# Altium schematic sheet MOD-SH-RFDET-01.SchDoc
size 558 x 431 mm; Date: Not shown in title block; ApprovedBy: Not shown in title block; CheckedBy: Not shown in title block; Author: Not shown in title block; CompanyName: Not shown in title block; Engineer: Not shown in title block; Organization: Not shown in title block; Address1: Not shown in title block; Address2: Not shown in title block; Address3: Not shown in title block; Address4: Not shown in title block; DocumentNumber: 2; Revision: Use project parameter SCH_Rev; SheetNumber: 2; SheetTotal: 3; PageSetup: Record=PageOptions|CenterHorizontal=True|CenterVertical=True|PrintScale=1.00|XCorrection=1.00|YCorrection=1.00|PrintKind=0|BorderSize=5000000|LeftOffset=0|BottomOffset=0|Orientation=2|PaperLength=1000|PaperWidth=1000|Scale=100|PaperSource=15|PrintQuality=600|MediaType=1|DitherType=10|PaperKind=Letter|PrintScaleMode=1; SPICEModelCacheSBTADDDQ: <root> / <DocumentId>SBTADDDQ</DocumentId> / <CacheFrame Number="0"> / <Model Name="7332_744878101_100u" Kind="CKT"> / <Text>****** / .subckt 7332_744878101_100u  1  2  3  4  PARAMS: / +  Cww=9.41p / +  Rp1=63426.1945521 / +  Cp1=10.419700222087p / +  Lp1=87.02321671935u / +  Rp2=63426.1945521 / +  Cp2=10.419700222087p / +  Lp2=87.02321671935u / +  RDC1=1.16899999976158 / +  RDC2=1.16899999976158 / +  K=0.938248462535577 / C_C1  2  1    {Cww/2} / R_R50  2  1  5000g / C_C2  3  4    {Cww/2} / C_C5  3  2    {Cp1} / R_R1  3  N05454    {RDC1} / R_R2  3  2    {Rp1} / L_L1  N05454  2    {Lp1} / L_L2  N05750  1    {Lp2} / C_C6  4  1    {Cp2} / R_R3  4  1    {Rp2} / R_R4  4  N05750    {RDC2} / Kn_K1  L_L1  L_L2      {K} / .ends</Text> / </Model> / </CacheFrame> / </root>; CurrentTime: Not shown in title block; CurrentDate: Not shown in title block; Time: Not shown in title block; DocumentFullPathAndName: Not shown in title block; DocumentName: Not shown in title block; ModifiedDate: Not shown in title block; ImagePath: Not shown in title block
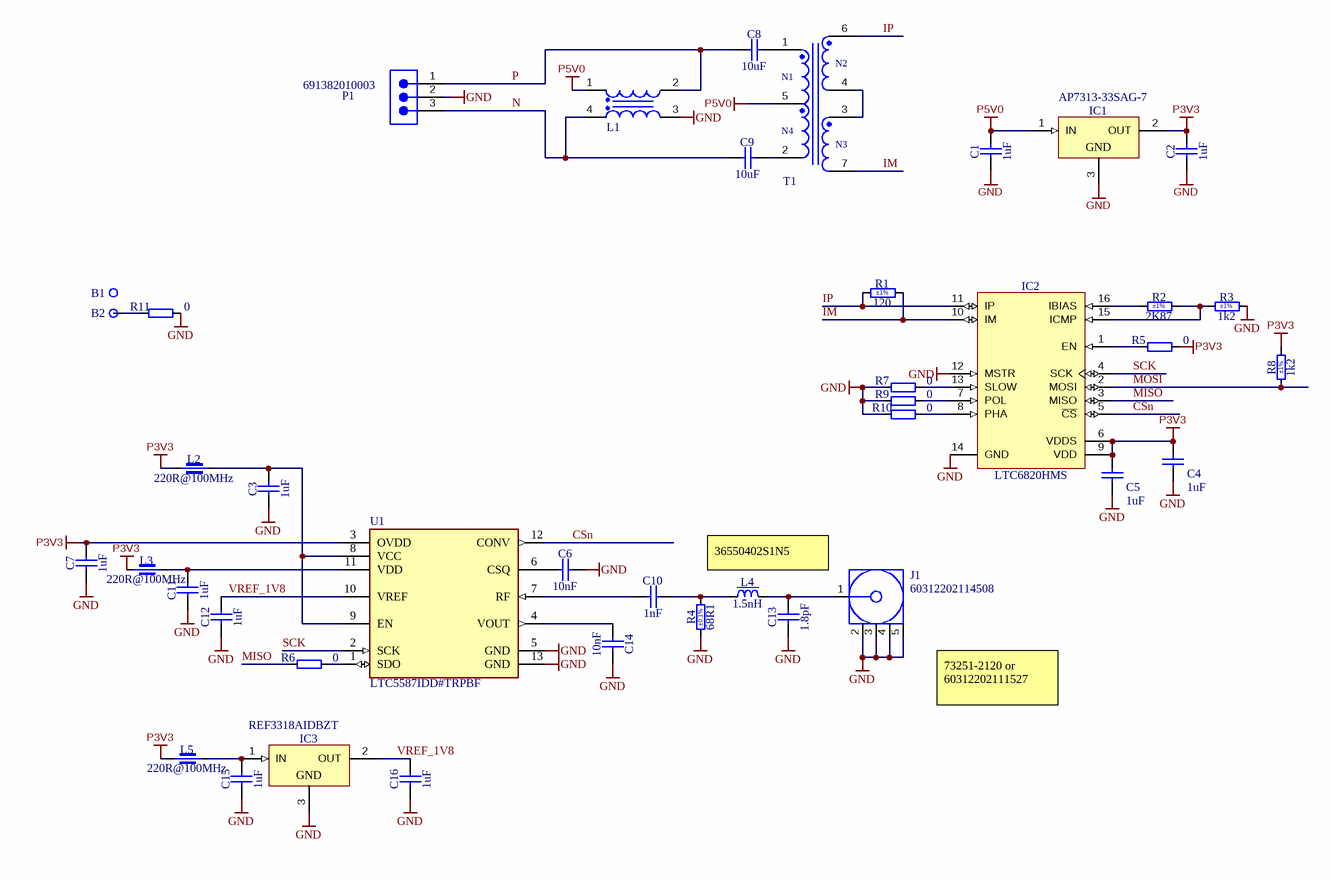
[diagram p0: MOD-SH-RFDET-01.SchDoc]

## Parts
B1  Plated Hole  [MTG320_550]  (value not drawn)  (no BOM)
B2  Plated Hole  [MTG320_550]  (value not drawn)  (no BOM)
C1  1uF  [CAPC1005X55N]
C2  1uF  [CAPC1005X55N]
C3  1uF  [CAPC1005X55N]
C4  1uF  [CAPC1005X55N]
C5  1uF  [CAPC1005X55N]
C6  10nF  [CAPC1608X87N]
C7  1uF  [CAPC1005X55N]
C8  10uF  [CAPC1608X80N]
C9  10uF  [CAPC1608X80N]
C10  1nF  [CAPC1005X55N]
C11  1uF  [CAPC1005X55N]
C12  1uF  [CAPC1005X55N]
C13  1.8pF  [CAPC1005X55N]
C14  10nF  [CAPC1608X87N]
C15  1uF  [CAPC1005X55N]
C16  1uF  [CAPC1005X55N]
IC1  AP7313-33SAG-7  [SOT95P240X130-3N]
IC2  LTC6820HMS  [SOP50P490X110-16N]
IC3  REF3318AIDBZT  [SOT95P237X112-3N]
J1  60312202114508  [60312202114508]
L1  100µH, 0.3A  [WE-DD_7332]  (value not drawn)
L2  220R@100MHz  [INDC1608X95N]
L3  220R@100MHz  [INDC1608X95N]
L4  1.5nH  [IND_MURATA_LQP15MN_02]
L5  220R@100MHz  [INDC1608X95N]
P1  691382010003  [691382010003]
R1  120  Tolerance: ±1%  [RESC1608X55N]
R2  2K87  Tolerance: ±1%  [RESC1005X40N]
R3  1k2  Tolerance: ±1%  [RESC1005X40N]
R4  68R1  Tolerance: ±0.1%  [RESC2012X60N]
R5  0  [RESC1005X40N]
R6  0  [RESC1005X40N]
R7  0  [RESC1005X40N]
R8  1k2  Tolerance: ±1%  [RESC1005X40N]
R9  0  [RESC1005X40N]
R10  0  [RESC1005X40N]
R11  0  [RESC1005X40N]
T1  74930030  [74930030]  (value not drawn)
U1  LTC5587IDD#TRPBF  [FP-DD-12-05-08-1725-IPC_A]

## Nets
GND: C1.1 C2.1 C3.1 C4.1 C5.1 C6.2 C7.1 C11.1 C12.1 C13.1 C14.2 C15.1 C16.1 IC1.3(GND) IC2.12(MSTR) IC2.14(GND) IC3.3(GND) J1.2(GND) J1.3(GND) J1.4(GND) J1.5(GND) L1.3 P1.2 R3.2 R4.1 R7.1 R9.1 R10.1 R11.2 U1.5(GND) U1.13(GND)
P3V3: C2.2 C4.2 C5.2 C7.2 IC1.2(OUT) IC2.6(VDDS) IC2.9(VDD) L2.1 L3.1 L5.1 R5.2 R8.2 U1.3(OVDD)
P5V0: C1.2 IC1.1(IN) L1.1 T1.5
CSn: IC2.5(~{CS}) U1.12(CONV)
IM: IC2.10(IM) R1.2 T1.7
IP: IC2.11(IP) R1.1 T1.6
MISO: IC2.3(MISO) R6.1
MOSI: IC2.2(MOSI) R8.1
N: C9.1 L1.4 P1.3
P: C8.1 L1.2 P1.1
SCK: IC2.4(SCK) U1.2(SCK)
VREF_1V8: C12.2 C16.2 IC3.2(OUT) U1.10(VREF)
NetB2_1: B2.1 R11.1
NetC3_2: C3.2 L2.2 U1.8(VCC) U1.9(EN)
NetC6_1: C6.1 U1.6(CSQ)
NetC8_2: C8.2 T1.1
NetC9_2: C9.2 T1.2
NetC10_1: C10.1 U1.7(RF)
NetC10_2: C10.2 L4.1 R4.2
NetC11_2: C11.2 L3.2 U1.11(VDD)
NetC13_2: C13.2 J1.1(Signal) L4.2
NetC14_1: C14.1 U1.4(VOUT)
NetC15_2: C15.2 IC3.1(IN) L5.2
NetIC2_1: IC2.1(EN) R5.1
NetIC2_7: IC2.7(POL) R9.2
NetIC2_8: IC2.8(PHA) R10.2
NetIC2_13: IC2.13(SLOW) R7.2
NetIC2_15: IC2.15(ICMP) R2.2 R3.1
NetIC2_16: IC2.16(IBIAS) R2.1
NetR6_2: R6.2 U1.1(SDO)
NetT1_3: T1.3 T1.4

Not connected (* = marked no-connect by the designer): B1 1

## Notes on the sheet
- 36550402S1N5
- (near J1) 73251-2120 or
  60312202111527
- Drawn By:
- SVN Rev:
- Number:
- TID #:
- Orderable:
- Rev:
- Sheet Title:
- File:
- Project Title:
- Designed for:
- Assembly Variant:
- Mod. Date:
- Sheet:
- Size:
- of
- C
- http://www.ti.com
- Texas Instruments and/or its licensors do not warrant the accuracy or completeness of this specification or any information contained therein. Texas Instruments and/or its licensors do not warrant that this design will meet the specifications, will be suitable for your application or fit for any particular purpose, or will operate in an implementation. Texas Instruments and/or its licensors do not warrant that the design is production worthy. You should completely validate and test your design implementation to confirm the system functionality for your application.
- Engineer:
- Contact:
- © Texas Instruments
- (in symbol 74930030) N2; N1; N4; N3

## Library data of the parts
B1 B2 = PLATED_HOLE3.2_PAD5.5: Single Terminal Socket; Part Description: Plated Through Hole: Hole Dia.=3.2mm Pad Dia.=5.5mm; Mounted: No; Part Number: PLATED_HOLE3.2_PAD5.5; Component Type: Standard (No BOM); Pin Count: 1; Family: Plated Hole; Socket: No; SMD: No; Sense: No; Status: None; ComponentHeight: 0mm; HelpURL: Undefined; Author: CERN DEM JMW; CreateDate: 01.10.2012; LatestRevisionDate: 01.10.2012; PackageDescription: Plated Through Hole: Hole Dia.=3.2mm Pad Dia.=5.5mm
C1-C5 C7 C11 C12 C15 C16 = CC0402_1UF_16V_10%_X5R: Non-polarised capacitor; Part Description: SMD Multilayer Chip Ceramic Capacitor; Manufacturer: GENERIC; Manufacturer1 Part Number: C1005X5R1C105KT; Voltage: 16V; TC: X5R; Tolerance: ±10%; Part Number: CC0402_1UF_16V_10%_X5R; Component Kind: Standard; Component Type: Standard; Pin Count: 2; Value: 1uF; Status: Preferred; Manufacturer Part Number: CC0402_1UF_16V_10%_X5R; Case: 0402; Mounted: Yes; Socket: No; SMD: Yes; Sense: No; Manufacturer1 Example: TDK; Manufacturer1 ComponentHeight: 0.55mm; HelpURL: \\cern.ch\dfs\Applications\Altium\Datasheets\CC0402_X5R_TDK_C.pdf; Author: CERN DEM JLC; CreateDate: 25.10.2012; LatestRevisionDate: 25.10.2012
C6 C14 = CC0603_10NF_50V_5%_C0G: Non-polarised capacitor; Part Description: SMD Multilayer Chip Ceramic Capacitor; Manufacturer: GENERIC; Manufacturer1 Part Number: C1608C0G1H103J080; Voltage: 50V; TC: C0G/NP0; Tolerance: ±5%; Part Number: CC0603_10NF_50V_5%_C0G; Component Kind: Standard; Component Type: Standard; Pin Count: 2; Value: 10nF; Status: Preferred; Manufacturer Part Number: CC0603_10NF_50V_5%_C0G; Case: 0603; Mounted: Yes; Socket: No; SMD: Yes; Sense: No; Manufacturer1 Example: TDK; Manufacturer1 ComponentHeight: 0.9mm; HelpURL: \\cern.ch\dfs\Applications\Altium\Datasheets\CC0603_C0G_TDK_C.pdf; Author: CERN DEM JLC; CreateDate: 10.12.2014; LatestRevisionDate: 10.12.2014
C8 C9 = CC0603_10UF_16V_20%_X5R: Non-polarised capacitor; Part Description: SMD Multilayer Chip Ceramic Capacitor; Manufacturer: GENERIC; Manufacturer1 Part Number: GRM188R61C106MA73D; Voltage: 16V; TC: X5R; Tolerance: ±20%; Part Number: CC0603_10UF_16V_20%_X5R; Component Kind: Standard; Component Type: Standard; Pin Count: 2; Value: 10uF; Status: None; Manufacturer Part Number: CC0603_10UF_16V_20%_X5R; Case: 0603; Mounted: Yes; Socket: No; SMD: Yes; Sense: No; Manufacturer1 Example: MURATA; Manufacturer1 ComponentHeight: 0.8mm; HelpURL: \\cern.ch\dfs\Applications\Altium\Datasheets\CC0603_X5R_MURATA_GRM.pdf; Author: CERN DEM MR; CreateDate: 02.03.2016; LatestRevisionDate: 02.03.2016
C10 = CC0402_1NF_50V_10%_X7R: Non-polarised capacitor; Part Description: SMD Multilayer Chip Ceramic Capacitor; Manufacturer: GENERIC; Manufacturer1 Part Number: 223858715623; Voltage: 50V; TC: X7R; Tolerance: ±10%; Part Number: CC0402_1NF_50V_10%_X7R; Component Kind: Standard; Component Type: Standard; Pin Count: 2; Value: 1nF; Status: Not Recommended; Manufacturer Part Number: CC0402_1NF_50V_10%_X7R; Case: 0402; Mounted: Yes; Socket: No; SMD: Yes; Sense: No; Manufacturer1 Example: PHYCOMP; Manufacturer1 ComponentHeight: 0.55mm; HelpURL: \\cern.ch\dfs\Applications\Altium\Datasheets\CC0402_X7R_PHYCOMP.pdf; Author: CERN DEM JLC; CreateDate: 03.12.2007; LatestRevisionDate: 03.12.2007
C13 = CC0402_1.8PF_50V_0.25PF_C0G: Non-polarised capacitor; Part Description: SMD Multilayer Chip Ceramic Capacitor; Manufacturer: GENERIC; Manufacturer1 Part Number: C0402C189C5GACTU; Voltage: 50V; TC: C0G/NP0; Tolerance: ±0.25pF; Part Number: CC0402_1.8PF_50V_0.25PF_C0G; Component Kind: Standard; Component Type: Standard; Pin Count: 2; Value: 1.8pF; Status: Preferred; Manufacturer Part Number: CC0402_1.8PF_50V_0.25PF_C0G; Case: 0402; Mounted: Yes; Socket: No; SMD: Yes; Sense: No; Manufacturer1 Example: KEMET; Manufacturer1 ComponentHeight: 0.55mm; HelpURL: \\cern.ch\dfs\Applications\Altium\Datasheets\CC0402_C0G_KEMET_(Commercial Grade).pdf; Author: CERN DEM JLC; CreateDate: 04.10.2016; LatestRevisionDate: 04.10.2016
IC1 = AP7313-33SAG-7: 3-Terminal Regulator 1=IN 2=OUT 3=GND; Part Description: 3.3V, 150mA Low Quiescent Current, Fast Transient Low Dropout Linear Regulator; Manufacturer: DIODES INCORPORATED; PressFit: No; Bonding: No; Part Number: AP7313-33SAG-7; Component Kind: Standard; Component Type: Standard; Device: AP7313-33SAG-7; PackageDescription: SOT23 3-Leads, Pitch 0.95mm - Body 1.3x2.9mm, IPC Medium Density; Manufacturer Part Number: AP7313-33SAG-7; Pin Count: 3; Case: SOT23; Mounted: Yes; Socket: No; SMD: Yes; Sense: No; ComponentHeight: 1.35mm; HelpURL: \\cern.ch\dfs\Applications\Altium\Datasheets\AP7313-33SAG-7.pdf; Author: CERN DEM JLC; CreateDate: 20.03.2018; LatestRevisionDate: 20.03.2018
IC2 = LTC6820HMS: isoSPI Isolated Communications Interface; Manufacturer: ANALOG DEVICES; PressFit: No; Bonding: No; Part Number: LTC6820HMS; Component Kind: Standard; Component Type: Standard; Device: LTC6820HMS; PackageDescription: SOP, 0.50mm Pitch; 16 Pin, 3.00mm W X 4.039mm L X 1.10mm H body, IPC Medium Density; Part Description: isoSPI Isolated Communications Interface; Manufacturer Part Number: LTC6820HMS; Pin Count: 16; Case: MSOP16; Mounted: Yes; Socket: No; SMD: Yes; Sense: No; ComponentHeight: 1.1mm; Author: CERN DEM BC; HelpURL: \\cern.ch\dfs\Applications\Altium\Datasheets\LTC6820HMS.pdf; CreateDate: 09.04.2020; LatestRevisionDate: 09.04.2020
IC3 = REF3318AIDBZT: 3-Terminal Regulator 1=IN 2=OUT 3=GND; Part Description: 1.8V, 30ppm/°C Drift, 3.9uA, Voltage Reference; Manufacturer: TEXAS INSTRUMENTS; PressFit: No; Bonding: No; Part Number: REF3318AIDBZT; Component Kind: Standard; Component Type: Standard; Device: REF3318AIDBZT; PackageDescription: SOT, 0.95mm Pitch; 3 Pin, 1.30mm W X 2.92mm L X 1.12mm H body, IPC Medium Density; Manufacturer Part Number: REF3318AIDBZT; Pin Count: 3; Case: SOT23-3; Mounted: Yes; Socket: No; SMD: Yes; Sense: No; ComponentHeight: 1.12mm; HelpURL: \\cern.ch\dfs\Applications\Altium\Datasheets\REF3318AIDBZT.pdf; Author: CERN DEM JLC; CreateDate: 20.06.2011; LatestRevisionDate: 20.06.2011
J1 = 60312202114508: WR-SMA Connector, PCB End Launch Jack, 6.35SQ Flange Round Post for PCB 1.1mm, DC~18GHz, 50Ω; Manufacturer: Wurth Elektronik; Center Contact Diameter: 0.76mm; Connector Type: SMA; Interface Type: MIL-STD-348; Manufacturer Part Number: 60312202114508; Category: Coaxial Connector; Match Code: WR-SMA; ComponentLink1Description: Website Link; ComponentLink1URL: https://www.we-online.com/redexpert/article/60312202114508?ad; ComponentLink2Description: Datasheet Link; ComponentLink2URL: https://www.we-online.com/redexpert/spec/60312202114508?ad; Mount: Surface Mount; Min Operating Temperature: -65°C; Max Operating Temperature: 165°C; Packaging: Tray; Frequency Range: DC~18GHz; Gender: Jack; Impedance: 50Ω; Orientation: Straight
L1 = 744878101: WE-DD SMT Shielded Coupled Inductor, size 7332, 100µH, 0.3A, 1730mΩ; Manufacturer: Wurth Elektronik; Case/Size Code: 7332; DC Resistance 1: 1400mΩ; Rated Voltage: 80V; Saturation Current: 0.7A; Self Resonant Frequency: 4MHz; Turns Ratio: 1:1; Type: Straight; Manufacturer Part Number: 744878101; Category: Coupled Power Inductors; Match Code: WE-DD; ComponentLink1Description: Website Link; ComponentLink1URL: https://www.we-online.com/redexpert/article/744878101?ad; ComponentLink2Description: Datasheet Link; ComponentLink2URL: https://www.we-online.com/redexpert/spec/744878101?ad; Mount: Surface Mount; Operating Temperature Max: 125°C; Operating Temperature Min: -40°C; Packaging: Tape and Reel; Length: 7.3mm; Width: 7.3mm; Height: 4mm; DC Resistance 2: 1400mΩ; DC Resistance Max 1: 1730mΩ; DC Resistance Max 2: 1730mΩ; Inductance 1: 100µH; Inductance 2: 100µH; Rated Current 1: 0.3A; Rated Current 2: 0.3A
L2 L3 L5 = IND0603_MURATA_BLM18SG221TN1: Part Description: SMD EMIFIL Suppression Chip Ferrite Bead; Manufacturer: MURATA; Power: 2.5A; Resistance: 0.04R; Tolerance: ±25%; Part Number: IND0603_MURATA_BLM18SG221TN1; Component Kind: Standard; Component Type: Standard; Pin Count: 2; Value: 220R@100MHz; Manufacturer Part Number: BLM18SG221TN1; Case: 0603; Mounted: Yes; Socket: No; SMD: Yes; Sense: No; ComponentHeight: 0.95mm; HelpURL: \\cern.ch\dfs\Applications\Altium\Datasheets\IND0603_MURATA_BLM18S.pdf; Author: CERN DEM MR; CreateDate: 08.01.2016; LatestRevisionDate: 25.10.2018
L4 = IND0402_1.5NH_0.1NH_MURATA_LQP15MN1N5B02: Inductor With Core; Part Description: Film Type RF Inductor; Manufacturer: MURATA; Power: 280mA; Resistance: 0.20R; Tolerance: ±0.1nH; Part Number: IND0402_1.5NH_0.1NH_MURATA_LQP15MN1N5B02; Component Kind: Standard; Component Type: Standard; Pin Count: 2; Value: 1.5nH; Manufacturer Part Number: LQP15MN1N5B02; Case: 0402; Mounted: Yes; Socket: No; SMD: Yes; Sense: No; ComponentHeight: 0.45mm; HelpURL: \\cern.ch\dfs\Applications\Altium\Datasheets\IND_MURATA_LQP15MN1N5B02.pdf; Author: CERN DEM BC; CreateDate: 08.06.2021; LatestRevisionDate: 08.06.2021
P1 = 691382010003: WR-TBL Series 382 Horizontal PCB Header, THT, pitch 2.5mm, 03p; Manufacturer: Wurth Elektronik; Modularity: No; Rated Current: 12A; System: Pluggable Connector; Working Voltage: 300V; Manufacturer Part Number: 691382010003; Category: Terminal Block; Match Code: WR-TBL; ComponentLink1Description: Website Link; ComponentLink1URL: https://www.we-online.com/redexpert/article/691382010003?ad; ComponentLink2Description: Datasheet Link; ComponentLink2URL: https://www.we-online.com/redexpert/spec/691382010003?ad; Mount: Through Hole; Min Operating Temperature: -40°C; Max Operating Temperature: 105°C; Packaging: Box; Application: Pluggable; Number of Pins: 3; Number of Rows: 1; Orientation: Horizontal; Pitch: 2.5mm
R1 = R0603_120R_1%_0.1W_100PPM: Resistor - 1%; Part Description: General Purpose Thick Film Chip Resistor; Manufacturer: GENERIC; Manufacturer1 Part Number: NRC06F1200TRF; Power: 0.1W; TC: ±100ppm/°C; PressFit: No; Part Number: R0603_120R_1%_0.1W_100PPM; Component Kind: Standard; Component Type: Standard; Pin Count: 2; Value: 120; Status: Preferred; Manufacturer Part Number: R0603_120R_1%_0.1W_100PPM; Case: 0603; Mounted: Yes; Sense: No; Socket: No; SMD: Yes; Manufacturer1 Example: NIC COMPONENT; Manufacturer1 ComponentHeight: 0.55mm; HelpURL: \\cern.ch\dfs\Applications\Altium\Datasheets\R0603_NIC_NRC.pdf; Author: CERN DEM JLC; CreateDate: 03.12.2007; LatestRevisionDate: 13.03.2008
R2 = R0402_2K87_1%_0.063W_100PPM: Resistor - 1%; Part Description: General Purpose Thick Film Chip Resistor; Manufacturer: GENERIC; Manufacturer1 Part Number: CRCW04022K87FK; Power: 0.063W; TC: ±100ppm/°C; PressFit: No; Part Number: R0402_2K87_1%_0.063W_100PPM; Component Kind: Standard; Component Type: Standard; Pin Count: 2; Value: 2K87; Status: None; Manufacturer Part Number: R0402_2K87_1%_0.063W_100PPM; Case: 0402; Mounted: Yes; Sense: No; Socket: No; SMD: Yes; Manufacturer1 Example: VISHAY; Manufacturer1 ComponentHeight: 0.4mm; HelpURL: \\cern.ch\dfs\Applications\Altium\Datasheets\R0402_VISHAY_CRCW e3.pdf; Author: CERN DEM BC; CreateDate: 08.02.2021; LatestRevisionDate: 08.02.2021
R3 R8 = R0402_1K2_1%_0.0625W_100PPM: Resistor - 1%; Part Description: General Purpose Thick Film Chip Resistor; Manufacturer: GENERIC; Manufacturer1 Part Number: 232270671202L; TC: ±100ppm/°C; PressFit: No; Part Number: R0402_1K2_1%_0.0625W_100PPM; Component Kind: Standard; Component Type: Standard; Pin Count: 2; Value: 1k2; Status: Not Recommended; Power: 0.0625W; Manufacturer Part Number: R0402_1K2_1%_0.0625W_100PPM; Case: 0402; Mounted: Yes; Sense: No; Socket: No; SMD: Yes; Manufacturer1 Example: YAGEO PHYCOMP; Manufacturer1 ComponentHeight: 0.4mm; HelpURL: \\cern.ch\dfs\Applications\Altium\Datasheets\R0402_Phycomp_RC0402.pdf; Author: CERN DEM JLC; CreateDate: 03.12.2007; LatestRevisionDate: 17.10.2012
R4 = R0805_68R1_0.1%_0.1W_10PPM: Resistor - 0.1%; Part Description: Thin Film Chip Resistor; Manufacturer: GENERIC; Manufacturer1 Part Number: RN73C2A68R1BTG; Power: 0.1W; TC: ±10ppm; PressFit: No; Part Number: R0805_68R1_0.1%_0.1W_10PPM; Component Kind: Standard; Component Type: Standard; Pin Count: 2; Value: 68R1; Status: Not Recommended; Manufacturer Part Number: R0805_68R1_0.1%_0.1W_10PPM; Case: 0805; Mounted: Yes; Sense: No; Socket: No; SMD: Yes; Manufacturer1 Example: TYCO HOLSWORTHY; Manufacturer1 ComponentHeight: 0.6mm; HelpURL: \\cern.ch\dfs\Applications\Altium\Datasheets\R0805_Tyco_RN73.pdf; Author: CERN DEM JLC; CreateDate: 03.12.2007; LatestRevisionDate: 13.03.2008
R5-R7 R9-R11 = R0402_0R_JUMPER: Resistor; Part Description: 1A (0.05R Max DC Resistance) Zero Ohm Jumper; Manufacturer: GENERIC; Manufacturer1 Part Number: 232270591001L; PressFit: No; Part Number: R0402_0R_JUMPER; Component Kind: Standard; Component Type: Standard; Pin Count: 2; Value: 0; Status: Not Recommended; Manufacturer Part Number: R0402_0R_JUMPER; Case: 0402; Mounted: Yes; Sense: No; Socket: No; SMD: Yes; Manufacturer1 Example: YAGEO PHYCOMP; Manufacturer1 ComponentHeight: 0.4mm; HelpURL: \\cern.ch\dfs\Applications\Altium\Datasheets\R0402_Phycomp_RC0402.pdf; Author: CERN DEM JLC; CreateDate: 03.12.2007; LatestRevisionDate: 17.10.2012
T1 = 74930030: WE-STST SMT Super Tiny Signal Transformer, size 4532, 1:1, 350uH; Manufacturer: Wurth Elektronik; Case/Size Code: 4532; Data Rate: 10/100/1GBase-T; Insulation Test Voltage: 1500Vrms; Manufacturer Part Number: 74930030; Category: Signal Transformers; Match Code: WE-STST; ComponentLink1Description: Website Link; ComponentLink1URL: https://www.we-online.com/redexpert/article/74930030?ad; ComponentLink2Description: Datasheet Link; ComponentLink2URL: https://www.we-online.com/redexpert/spec/74930030?ad; Mount: Surface Mount; Operating Temperature Max: 105°C; Operating Temperature Min: -40°C; Packaging: Tape and Reel; Length: 4.7mm; Width: 3.22mm; Height: 2.9mm; Application: Ethernet, PoE; Inductance: 350uH; Turns Ratio: 1:1
U1 = CMP-09141-000103-1: IC RF DETECT 10MHZ-6GHZ 12DFN; Frequency: 10MHz; Operating Supply Current: 3mA; Package Quantity: 2500; Case/Package: DFN EP; Number of Pins: 12; RoHS Compliant: Yes; Packaging: Tape and Reel